# EAGLE design singlecoil (EAGLE 9.5.2)
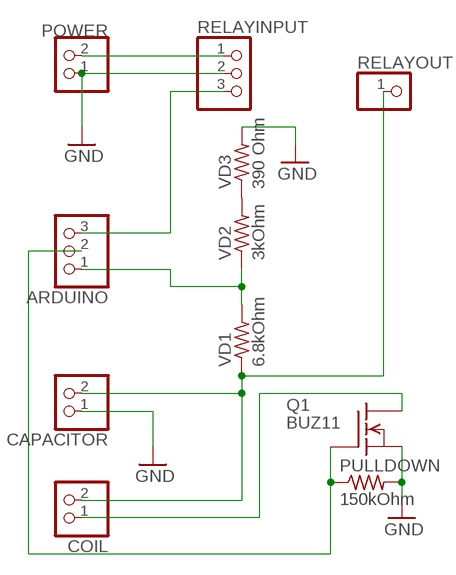
[diagram p0: schematic, sheet 1]

## Parts
ARDUINO  PINHD-1X3  [1X03]
CAPACITOR  PINHD-1X2  [1X02]
COIL  PINHD-1X2  [1X02]
POWER  PINHD-1X2  [1X02]
PULLDOWN  150kOhm  R-US_0204/2V  [0204V]
Q1  BUZ11  [TO220]
RELAYINPUT  PINHD-1X3  [1X03]
RELAYOUT  PINHD-1X1  [1X01]
VD1  6.8kOhm  R-US_0204/2V  [0204V]
VD2  3kOhm  R-US_0204/2V  [0204V]
VD3  390 Ohm  R-US_0204/2V  [0204V]

## Nets
GND: CAPACITOR.1 POWER.1 PULLDOWN.2 Q1.3(S) RELAYINPUT.2 VD3.2
N$1: POWER.2 RELAYINPUT.1
N$2: ARDUINO.1 VD1.2 VD2.1
N$4: ARDUINO.2 PULLDOWN.1 Q1.1(G)
N$5: COIL.1 Q1.2(D)
N$6: VD2.2 VD3.1
N$7: ARDUINO.3 RELAYINPUT.3
N$8: CAPACITOR.2 COIL.2 RELAYOUT.1 VD1.1

## Library data of the parts
ARDUINO RELAYINPUT = pinhead:PINHD-1X3: PIN HEADER
CAPACITOR COIL POWER = pinhead:PINHD-1X2: PIN HEADER
PULLDOWN VD1-VD3 = rcl:R-US_: RESISTOR, American symbol; SPICEPREFIX: R
Q1 = transistor-fet:BUZ11: N-Channel Enhancement MOSFET 50V; 30A; 0,040Ohm
RELAYOUT = pinhead:PINHD-1X1: PIN HEADER

## Board
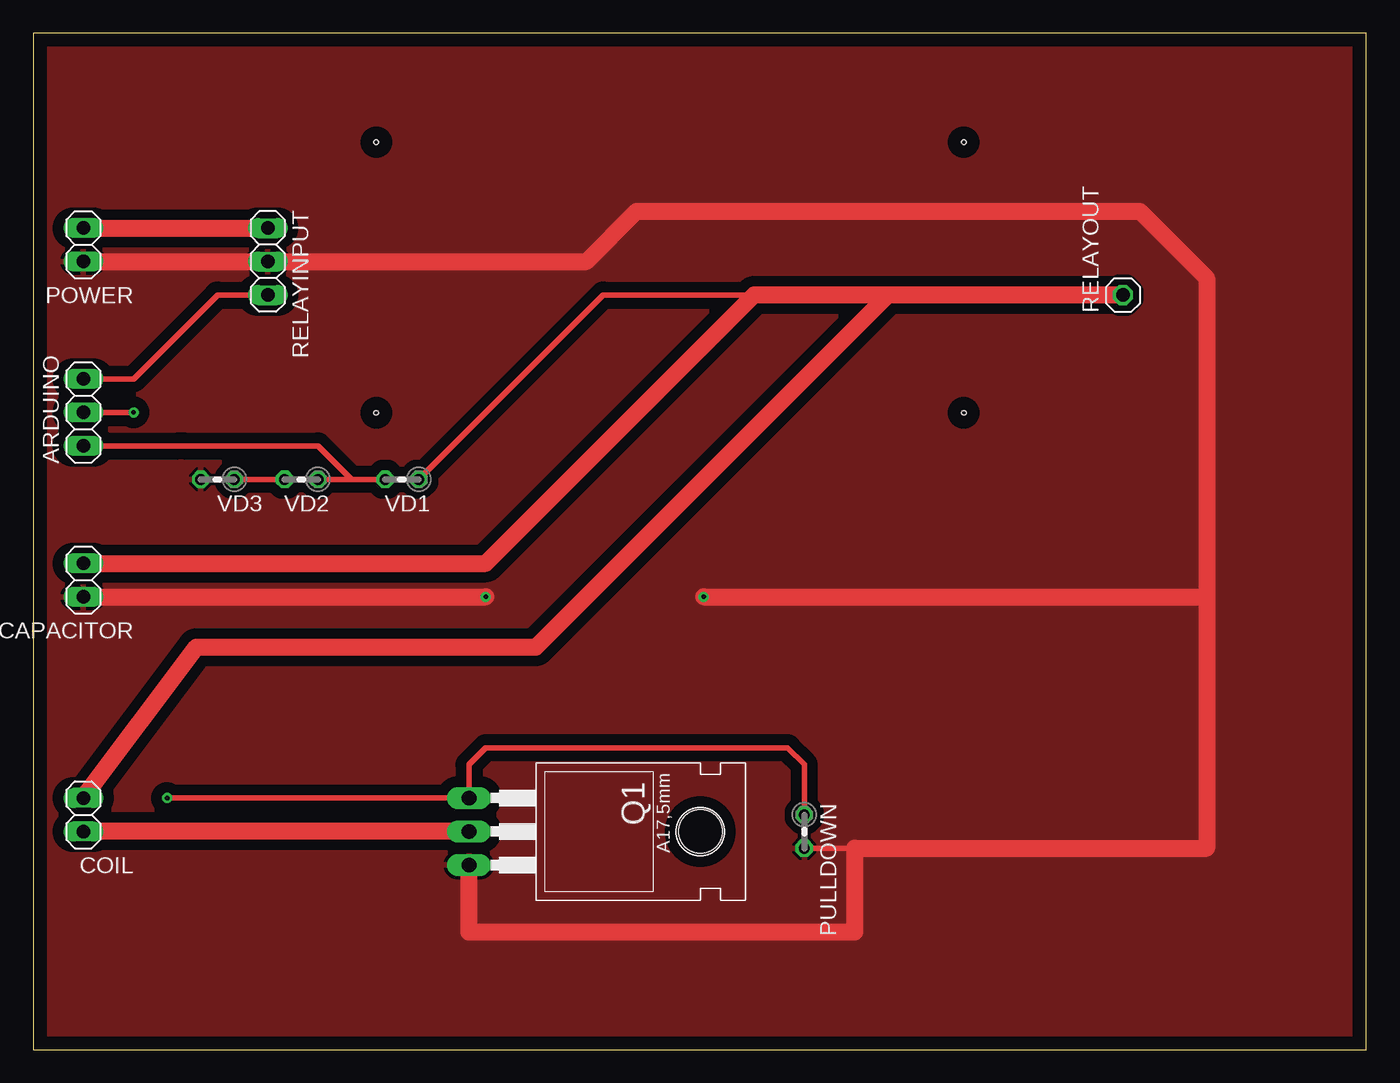
[diagram p1: board, top side]
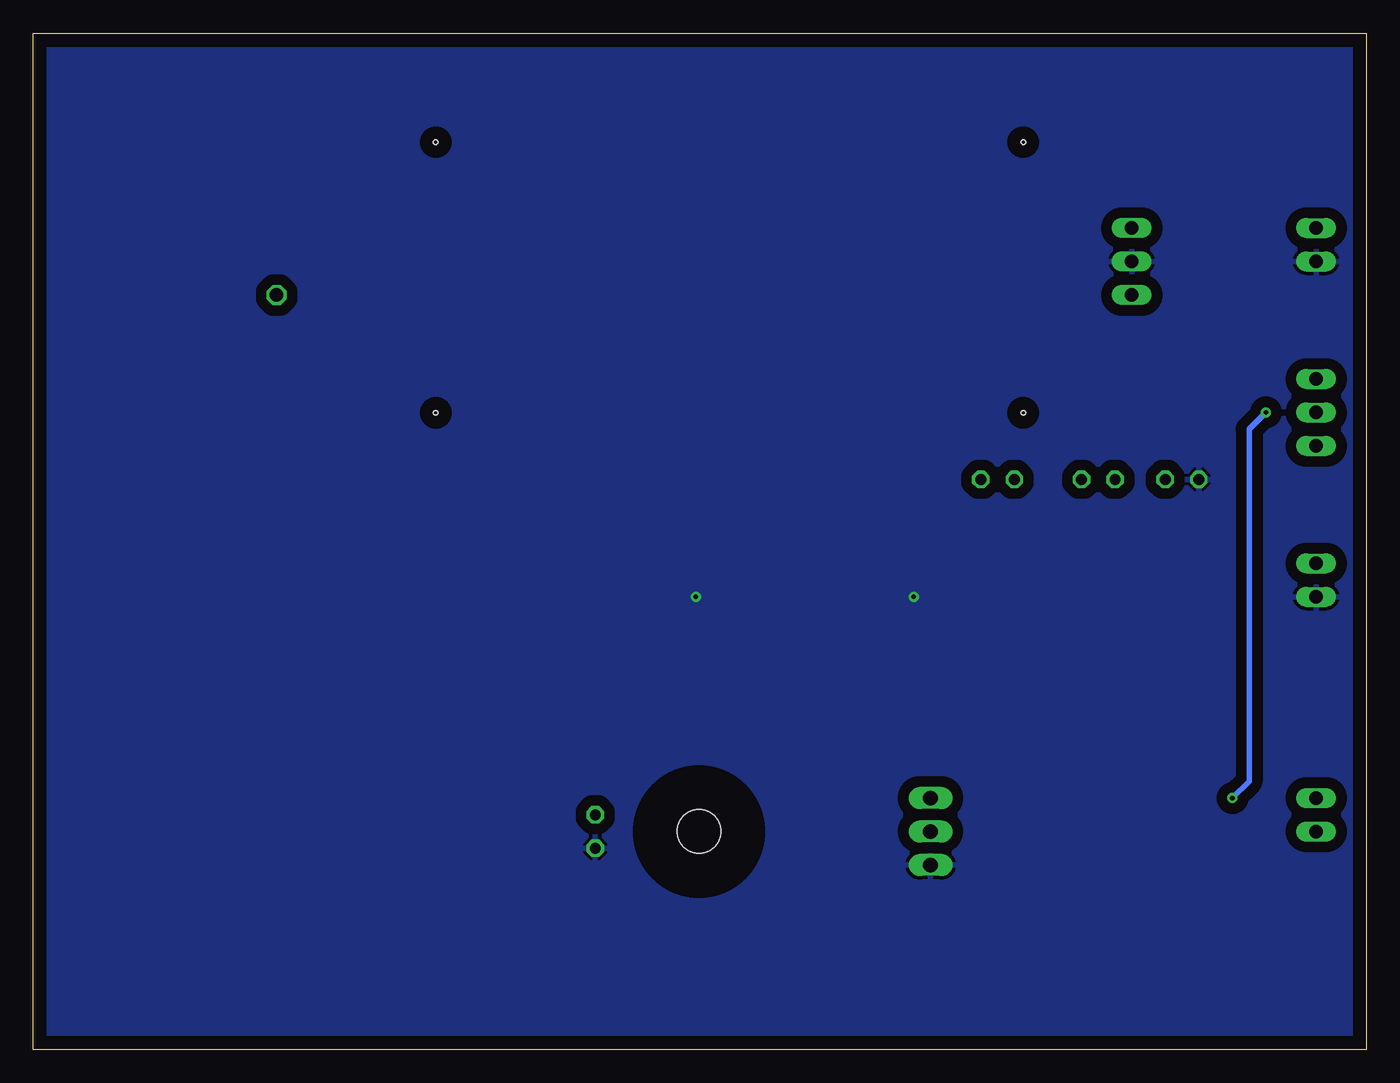
[diagram p2: board, bottom side, seen from below]

Size 101 x 77 mm. Coordinates in mm from the lower left corner, seen from the top.
Outline: 0,0 101,0 101,77 0,77 0,0
Copper layers (1*16): Top 0.035mm / dielectric 1.5mm / Bottom 0.035mm
Design rules "default": minimum track width 6mil, minimum drill 0.35mm, track to track 6mil, track to pad 6mil, pad to pad 6mil, via to via 6mil, smd to smd 6mil, copper to edge 40mil, drill to drill 6mil, minimum pad ring 10mil, minimum via ring 8mil, stop-mask expansion 4mil, vias tented up to drill 0mil, thermal gap 10mil
Holes 0.35 mm at 26,68.73 26,48.23 70.5,68.73 70.5,48.23

### Footprints (pad centres in the part's own frame; a part is rotated, then mirrored left to right if it is on the bottom)
1X03 = drill 1.016 long: 1 -2.54,0; 2 0,0; 3 2.54,0
1X02 = drill 1.016 long: 1 -1.27,0; 2 1.27,0
0204V = drill 0.813 octagon: 1 -1.27,0; 2 1.27,0
TO220 = drill 1.118 long: 1 -2.54,-6.35; 2 0,-6.35; 3 2.54,-6.35 | hole 3.302: 0,11.176
1X01 = drill 1.016 octagon: 1 0,0

### Placement (x,y rotation side)
ARDUINO  3.81,48.26 90 top
CAPACITOR  3.81,35.56 90 top
COIL  3.81,17.78 90 top
POWER  3.81,60.96 90 top
PULLDOWN  58.42,16.51 270 top
Q1  39.37,16.51 270 top
RELAYINPUT  17.78,59.69 270 top
RELAYOUT  82.55,57.15 90 top
VD1  27.94,43.18 180 top
VD2  20.32,43.18 180 top
VD3  13.97,43.18 180 top

### Tracks (layer width: path | path; a pad name or v marks a point on that pad's centre or on a via)
GND  (via drill 0.35)
  Top 0.406: PULLDOWN.2 62.23,15.24
  Top 1.27: POWER.1 RELAYINPUT.2 41.91,59.69 45.72,63.5 83.82,63.5 88.9,58.42 88.9,34.29 | 88.9,34.29 88.9,15.24 62.23,15.24 62.23,8.89 33.02,8.89 Q1.3 | CAPACITOR.1 v34.29,34.29 | v50.8,34.29 88.9,34.29
  pour Top (isolate 0.813): 0,0 0,77 101,77 101,0
  pour Bottom (isolate 0.813): 0,0 0,77 101,77 101,0
N$1
  Top 1.27: POWER.2 RELAYINPUT.1
N$2
  Top 0.406: VD1.2 24.13,43.18 | 24.13,43.18 VD2.1 | ARDUINO.1 11,45.72 11.43,45.72 21.59,45.72 24.13,43.18
N$4  (via drill 0.35)
  Top 0.406: PULLDOWN.1 58.42,21.59 57.15,22.86 34.29,22.86 33.02,21.59 Q1.1 v10.16,19.05 | ARDUINO.2 v7.62,48.26
  Bottom 0.406: v7.62,48.26 8.89,46.99 8.89,20.32 v10.16,19.05
N$5
  Top 1.27: Q1.2 COIL.1
N$6
  Top 0.406: VD2.2 VD3.1
N$7
  Top 0.406: RELAYINPUT.3 13.97,57.15 7.62,50.8 ARDUINO.3
N$8
  Top 0.406: VD1.1 43.18,57.15 54.61,57.15
  Top 1.27: CAPACITOR.2 34.29,36.83 54.61,57.15 64.77,57.15 | RELAYOUT.1 64.77,57.15 | 64.77,57.15 38.1,30.48 12.38,30.48 COIL.2